# Altium schematic sheet 1_P1.schdoc
size 435 x 313 mm
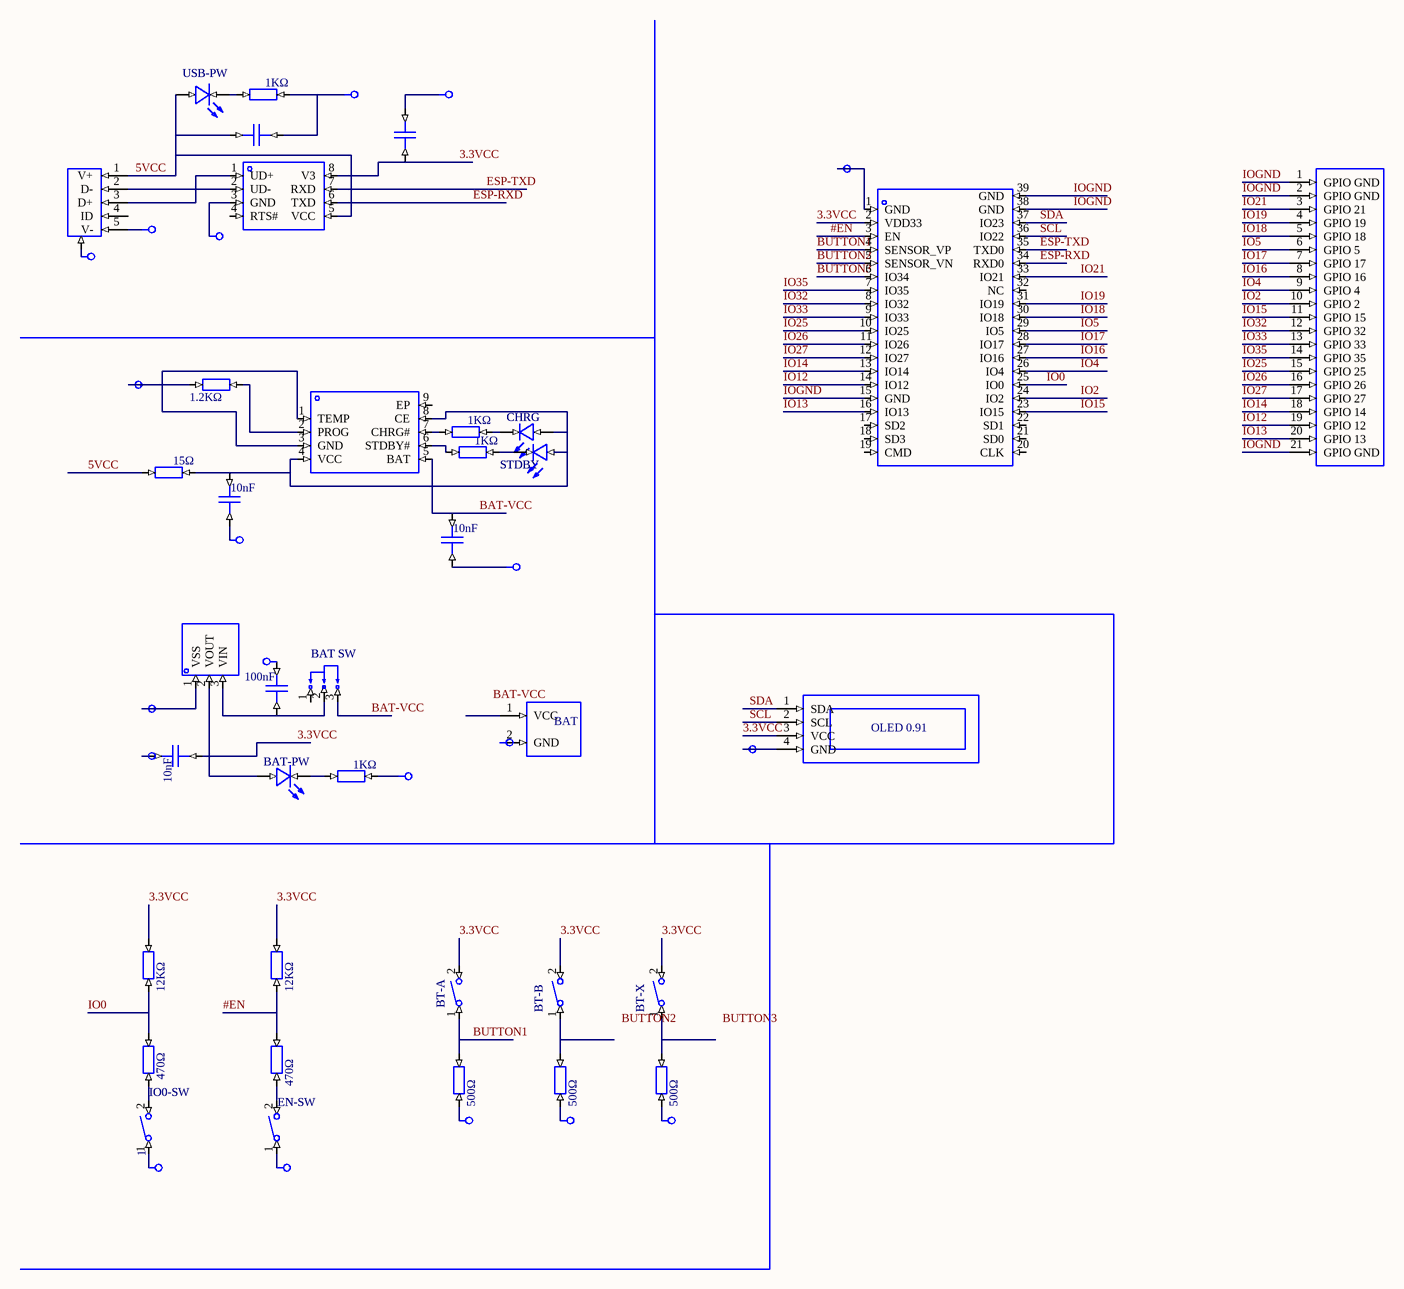
[diagram p0: 1_P1.schdoc]

## Parts
C1  value 100nF  [C0805]
C2  (no value)  [C0805]
C4  value 10nF  [C0805]
C5  value 10nF  [C0805]
C6  value 10nF  [C0805]
C7  (no value)  [C0805]
LDO1  (no value)  [SOT-23-3_L2.9-W1.6-P1.90-LS2.8-BR]
LED6  CHRG  [LED0805-R-RD]
LED7  STDBY  [LED0805-R-RD]
LED8  USB-PW  [LED0805-RD_RED]
LED9  BAT-PW  [LED0805-RD_RED]
R3  value 15Ω  [R0805]
R4  value 1KΩ  [R0805]
R5  value 1KΩ  [R0805]
R6  value 1.2KΩ  [R0805]
R7  value 1KΩ  [R0805]
R8  value 1KΩ  [R0805]
R10  value 12KΩ  [R0805]
R11  value 12KΩ  [R0805]
R12  value 470Ω  [R0805]
R13  value 470Ω  [R0805]
R15  value 500Ω  [R0805]
R16  value 500Ω  [R0805]
R17  value 500Ω  [R0805]
SW3  BAT SW  [SW-TH_SHOU-HAN_SS12D10G4]
U1  (no value)  [WIFIM-SMD_39P-L25.5-W18.0-P1.27-BL]
U2  (no value)  [SOP-8_L5.0-W4.0-P1.27-LS6.0-BL]
U3  (no value)  [SOP-8_L4.9-W3.9-P1.27-LS6.0-TL-EP-1]
U4  IO0-SW  NUMBER: 1  [SW-SMD_L4.0-W3.0-LS4.8-1]
U5  EN-SW  [SW-SMD_L4.0-W3.0-LS4.8-1]
U7  BT-A  [SW-SMD_L4.0-W3.0-LS4.8-1]
U8  BT-B  [SW-SMD_L4.0-W3.0-LS4.8-1]
U9  BT-X  [SW-SMD_L4.0-W3.0-LS4.8-1]
U11  (no value)  [ESP32 Pioneer OUT PIN20]
U12  (no value)  [0.91寸 OLED 屏幕模块]
U16  (no value)  [Battery Pin]
USB1  (no value)  [MICRO-USB]

## Nets
GND: C1.1 C2.2 C4.2 C5.2 C6.2 C7.2 LDO1.1(VSS) R6.1 R7.1 R8.1 R15.1 R16.1 R17.1 U1.1(GND) U2.3(GND) U3.1(TEMP) U3.3(GND) U4.1 U5.1 U12.4(GND) U16.2(GND) USB1.0(MTN6) USB1.5(V-)
3.3VCC: C4.1 C7.1 LDO1.2(VOUT) LED9.2(+) R10.2 R11.2 U1.2(VDD33) U2.8(V3) U7.2 U8.2 U9.2 U12.3(VCC)
5VCC: C2.1 LED8.2(+) R3.2 U2.5(VCC) USB1.1(V+)
#EN: R11.1 R13.2 U1.3(EN)
BAT-VCC: C6.1 SW3.3 U3.5(BAT)
BUTTON1: R15.2 U1.4(SENSOR_VP) U7.1
BUTTON2: U1.5(SENSOR_VN)
BUTTON3: U1.6(IO34)
ESP-RXD: U1.34(RXD0) U2.6(TXD)
ESP-TXD: U1.35(TXD0) U2.7(RXD)
IO0: R10.1 R12.2 U1.25(IO0)
IO2: U1.24(IO2) U11.10(GPIO_2)
IO4: U1.26(IO4) U11.9(GPIO_4)
IO5: U1.29(IO5) U11.6(GPIO_5)
IO12: U1.14(IO12) U11.19(GPIO_12)
IO13: U1.16(IO13) U11.20(GPIO_13)
IO14: U1.13(IO14) U11.18(GPIO_14)
IO15: U1.23(IO15) U11.11(GPIO_15)
IO16: U1.27(IO16) U11.8(GPIO_16)
IO17: U1.28(IO17) U11.7(GPIO_17)
IO18: U1.30(IO18) U11.5(GPIO_18)
IO19: U1.31(IO19) U11.4(GPIO_19)
IO21: U1.33(IO21) U11.3(GPIO_21)
IO25: U1.10(IO25) U11.15(GPIO_25)
IO26: U1.11(IO26) U11.16(GPIO_26)
IO27: U1.12(IO27) U11.17(GPIO_27)
IO32: U1.8(IO32) U11.12(GPIO_32)
IO33: U1.9(IO33) U11.13(GPIO_33)
IO35: U1.7(IO35) U11.14(GPIO_35)
IOGND: U1.15(GND) U1.38(GND) U1.39(GND) U11.1(GPIO_GND) U11.2(GPIO_GND) U11.21(GPIO_GND)
SCL: U1.36(IO22) U12.2(SCL)
SDA: U1.37(IO23) U12.1(SDA)
NetC1_2: C1.2 LDO1.3(VIN) SW3.2
NetC5_1: C5.1 LED6.1(A) LED7.1(A) R3.1 U3.4(VCC) U3.8(CE)
NetLED6_2: LED6.2(C) R5.1
NetLED7_2: LED7.2(C) R4.1
NetLED8_1: LED8.1(-) R7.2
NetLED9_1: LED9.1(-) R8.2
NetR4_2: R4.2 U3.6(STDBY#)
NetR5_2: R5.2 U3.7(CHRG#)
NetR6_2: R6.2 U3.2(PROG)
NetR12_1: R12.1 U4.2
NetR13_1: R13.1 U5.2
NetR16_2: R16.2 U8.1
NetR17_2: R17.2 U9.1
NetU2_1: U2.1(UD+) USB1.3(D+)
NetU2_2: U2.2(UD-) USB1.2(D-)

Not connected (* = marked no-connect by the designer): SW3 1; U1 17(SD2) 18(SD3) 19(CMD) 20(CLK) 21(SD0) 22(SD1) 32(NC); U2 4(RTS#); U3 9(EP); U16 1(VCC); USB1 4(ID)

## Notes on the sheet
- Labels drawn without touching a wire or pin: BAT-VCC, BUTTON2, BUTTON3
- (in symbol 0.91寸 OLED 屏幕模块_1) OLED 0.91
- (in symbol Battery Pin) BAT

## Library data of the parts
C1 C4-C6 = FM21X104K101ECG: Manufacturer: PSA(信昌电陶); Add into BOM: yes; Temperature Coefficient: X7R; Tolerance: ±10%; Voltage Rated: 100V; Description: 温度系数:X7R;容值:100nF;精度:±10%;额定电压:100V;; Symbol: FM21X104K101ECG; Device: FM21X104K101ECG; LCSC Part Name: 100nF ±10% 100V; Supplier Part: C148241; Manufacturer Part: FM21X104K101ECG; LCSC Stock: 829153; LCSC On Sale: 1; Supplier Footprint: 0805; Price: 0.036; JLCPCB Part Class: Extended Part; JLCPCB Stock: 150900; JLCPCB On Sale: 1; Datasheet: https://atta.szlcsc.com/upload/public/pdf/source/20171221/C148241_15138312092361195434.pdf; Supplier: LCSC; Convert to PCB: yes
C2 C7 = C0805X104K101T_C485772: Manufacturer: IHHEC(禾伸堂); Add into BOM: yes; Temperature Coefficient: X7R; Value: 100nF; Tolerance: ±10%; Voltage Rated: 100V; Description: 温度系数:X7R;容值:100nF;精度:±10%;额定电压:100V;; Symbol: C0805X104K101T_C485772; Device: C0805X104K101T_C485772; LCSC Part Name: 100nF ±10% 100V; Supplier Part: C485772; Manufacturer Part: C0805X104K101T; LCSC Stock: 1286668; LCSC On Sale: 1; Supplier Footprint: 0805; Price: 0.099; JLCPCB Part Class: Extended Part; JLCPCB Stock: 718060; JLCPCB On Sale: 1; Datasheet: https://atta.szlcsc.com/upload/public/pdf/source/20200117/C485772_1C2A03D89DC7D3F931FB9AFBA2903E68.pdf; Supplier: LCSC; Convert to PCB: yes
LDO1 = ME6209A33M3G: Manufacturer: MICRONE(南京微盟); Add into BOM: yes; Voltage Dropout (Max): 80mV @ 40mA(typ); Output Current (Max): 250mA; Output Configuration: 正; Voltage - Input (Max): 18V; Output Type: 固定; Number of Output Channels: 1; Current - Supply (Max): 4μA; Voltage - Output (Fixed): 3.3V; Description: 压降(max):80mV @ 40mA(typ);输出电压(可调):-;静态电流(Iq):-;最大输入电压:18V;输出类型:固定;输出电压(固定):3.3V;; Symbol: ME6209A33M3G; Device: ME6209A33M3G; LCSC Part Name: ME6209A33M3G; Supplier Part: C83508; Manufacturer Part: ME6209A33M3G; LCSC Stock: 86650; LCSC On Sale: 1; Supplier Footprint: SOT-23-3L; Price: 0.435; JLCPCB Part Class: Extended Part; JLCPCB Stock: 1130; JLCPCB On Sale: 1; Datasheet: https://atta.szlcsc.com/upload/public/pdf/source/20161212/1481539101152.pdf; Supplier: LCSC; Convert to PCB: yes; Voltage - Output (adj): -; Quiescent Current (Iq): -; Ripple Rejection (PSRR): -; Operating Temperature: -40℃~85℃; Enabling feet: -
LED6 LED7 = 17-21/GHC-XS1T2M/3T: Manufacturer: EVERLIGHT(台湾亿光); Add into BOM: yes; Illumination Color: 翠绿; Luminous Intensity (IF=20mA): 180~450mcd; Dominant Wavelength / Coordinate rank: 515~530nm; Description: 照明颜色:翠绿;色温 - CCT（K）:-;主波长/色坐标:515~530nm;; Symbol: 17-21/GHC-XS1T2M/3T; Device: 17-21/GHC-XS1T2M/3T; LCSC Part Name: 翠绿LED; Supplier Part: C63855; Manufacturer Part: 17-21/GHC-XS1T2M/3T; LCSC Stock: 184761; LCSC On Sale: 1; Supplier Footprint: 0805; Price: 0.267; JLCPCB Part Class: Extended Part; JLCPCB Stock: 38627; JLCPCB On Sale: 1; Datasheet: https://atta.szlcsc.com/upload/public/pdf/source/20151222/1457707652176.pdf; Supplier: LCSC; Convert to PCB: yes; Mounting Type: 表面贴装; Correlated Color Temperature - CCT(K): -; Luminous Flux/Radiant Flux: -
  LED6: Name: CHRG
  LED7: Name: STDBY
LED8 LED9 = NCD0805R1: Manufacturer: 国星光电; Symbol: FC-2012HRK-620D; Add into BOM: yes; Illumination Color: 红色; Luminous Intensity (IF=20mA): 67~195mcd; Dominant Wavelength / Coordinate rank: 615~630nm; Description: 照明颜色:红色;主波长/色坐标:615~630nm;; Device: NCD0805R1; LCSC Part Name: 红灯 0805 贴片LED; Supplier Part: C84256; Manufacturer Part: NCD0805R1; LCSC Stock: 1742470; LCSC On Sale: 1; Supplier Footprint: 0805; Price: 0.07; JLCPCB Part Class: Basic Part; JLCPCB Stock: 105919; JLCPCB On Sale: 1; Datasheet: https://atta.szlcsc.com/upload/public/pdf/source/20200820/C84256_F0A75A43B3EAD75808600A0514C76B99.pdf; Supplier: LCSC; Convert to PCB: yes; Mounting Type: 表面贴装
  LED8: Name: USB-PW
  LED9: Name: BAT-PW
R3-R6 = TC0550B150JT5E: Manufacturer: UNI-ROYAL(厚声); Add into BOM: yes; Temperature Coefficient: ±50ppm/℃; Power(Watts): 1/4W; Tolerance: ±0.1%; Overload Voltage (Max): 150V; Description: 温度系数:±50ppm/℃;阻值:15Ω;功率:1/4W;精度:±0.1%;工作温度范围:-55℃~+155℃;最大工作电压:150V;; Symbol: TC0550B150JT5E; Device: TC0550B150JT5E; LCSC Part Name: 15Ω ±0.1%; Supplier Part: C64288; Manufacturer Part: TC0550B150JT5E; LCSC Stock: 0; LCSC On Sale: 1; Supplier Footprint: 0805; Price: 0.25; JLCPCB Part Class: Extended Part; JLCPCB Stock: 0; JLCPCB On Sale: 1; Datasheet: https://atta.szlcsc.com/upload/public/pdf/source/20190404/C64288_0975AAA3CE83BB898B881ED2F6ECC9A4.pdf; Supplier: LCSC; Convert to PCB: yes; Operating Temperature Range: -55℃~+155℃
R7 R8 R10-R13 R15-R17 = TC0525B3241T5E: Manufacturer: UNI-ROYAL(厚声); Add into BOM: yes; Power(Watts): 250mW; Tolerance: ±0.1%; Overload Voltage (Max): 150V; Temperature Coefficient: ±25ppm/℃; Description: 工作温度范围:-55℃~+155℃;功率:250mW;电阻长:-;精度:±0.1%;电阻直径:-;电阻高:-;最大工作电压:150V;电阻宽:-;阻值:3.24kΩ;温度系数:±25ppm/℃;电阻类型:薄膜电阻;; Symbol: TC0525B3241T5E; Device: TC0525B3241T5E; LCSC Part Name: 3.24kΩ ±0.1%; Supplier Part: C64285; Manufacturer Part: TC0525B3241T5E; LCSC Stock: 20660; LCSC On Sale: 1; Supplier Footprint: 0805; Price: 0.259; JLCPCB Part Class: Extended Part; JLCPCB Stock: 90; JLCPCB On Sale: 1; Datasheet: https://atta.szlcsc.com/upload/public/pdf/source/20190404/C64285_98BBE841B3AD9F64F3238CC1E09794B8.pdf; Supplier: LCSC; Convert to PCB: yes; Operating Temperature Range: -55℃~+155℃; Body Length: -; φD: -; Body Height: -; Body Width: -; Type: 薄膜电阻
SW3 = SS12D10G4 071: Manufacturer: SHOU HAN(首韩); Add into BOM: yes; Description: 立式两档拨动,单排3脚插件,12.7x6.7x6.4,黑柄4MM; Symbol: SS12D10G4 071; Name: BAT SW; Device: SS12D10G4 071; LCSC Part Name: SS12D10G4 071; Supplier Part: C2887259; Manufacturer Part: SS12D10G4 071; LCSC Stock: 1048; LCSC On Sale: 1; Supplier Footprint: 插件; Price: 0.847; JLCPCB Part Class: Extended Part; JLCPCB Stock: 401; JLCPCB On Sale: 1; Datasheet: https://atta.szlcsc.com/upload/public/pdf/source/20210820/80D1704BBF3FCEE0435FCAA54C61E0A3.pdf; Supplier: LCSC; Convert to PCB: yes
U1 = ESP32-WROOM-32D: Manufacturer: ESPRESSIF 乐鑫; Add into BOM: yes; Description: ESP32-WROOM-32D 集成 ESP32-D0WD，功能强大，用途广泛，可以用于低功耗传感器网络和要求极高的任务，例如语音编码、音频流和 MP3 解码等。; Symbol: ESP32-WROOM-32D; Device: ESP32-WROOM-32D; LCSC Part Name: ESP32-WROOM-32D; Supplier Part: C473012; Manufacturer Part: ESP32-WROOM-32D; LCSC Stock: 1657; LCSC On Sale: 1; Supplier Footprint: SMD-38; Price: 20.48; JLCPCB Part Class: Extended Part; JLCPCB Stock: 5028; JLCPCB On Sale: 1; Datasheet: https://atta.szlcsc.com/upload/public/pdf/source/20191225/C473012_1E74417EE995DBCF17C94BD318A37DAB.pdf; Supplier: LCSC; Convert to PCB: yes
U2 = CH340N: Manufacturer: WCH(南京沁恒); Add into BOM: yes; Description: 类型:-;协议类别:-;驱动器/接收器数:-;数据速率:-;; Symbol: CH340N; Device: CH340N; LCSC Part Name: CH340N; Supplier Part: C506813; Manufacturer Part: CH340N; LCSC Stock: 0; LCSC On Sale: 1; Supplier Footprint: SOP-8; Price: 3.52; JLCPCB Part Class: Extended Part; JLCPCB Stock: 0; JLCPCB On Sale: 1; Datasheet: https://atta.szlcsc.com/upload/public/pdf/source/20200819/C84681_ADBED554CE321879DBD6B1D06488689C.pdf; Supplier: LCSC; Convert to PCB: yes; Type: -; Protocol: -; Number of Drivers/Receivers: -; Data Rate: -; Supply Voltage: -
U3 = TP4056X_C2763448: Manufacturer: TOPPOWER(南京拓微); Add into BOM: yes; Description: 充电电池的类型:-;电池单元组数:-;最大充电电流:-;充满的电池组电压:-;最大供应电压:-;; Symbol: TP4056X_C2763448; Device: TP4056X_C2763448; LCSC Part Name: TP4056X; Supplier Part: C2763448; Manufacturer Part: TP4056X; LCSC Stock: 50301; LCSC On Sale: 1; Supplier Footprint: SOP-8EP_150mil; Price: 1.347; JLCPCB Part Class: Extended Part; JLCPCB Stock: 0; JLCPCB On Sale: 1; Datasheet: https://atta.szlcsc.com/upload/public/pdf/source/20180424/C191323_1370BE5C4DD73DE4435E0781559DEFAC.pdf; Supplier: LCSC; Convert to PCB: yes; Battery Chemistry: -; Number of Cells: -; Charge Current - Max: -; Battery Pack Voltage: -; Voltage - Supply (Max): -; Interface: -
U4 U5 U7-U9 = 3*4 龟仔/微动/轻触开关: Add into BOM: yes; Symbol: 3*4 龟仔/微动/轻触开关; Device: 3*4 龟仔/微动/轻触开关; LCSC Part Name: 3*4 龟仔/微动/轻触开关; Supplier Part: C9900001368; Manufacturer Part: 3*4 龟仔/微动/轻触开关; LCSC Stock: 0; LCSC On Sale: 0; Supplier Footprint: SMD; Price: 0; JLCPCB Part Class: Extended Part; JLCPCB Stock: 0; JLCPCB On Sale: 0; Datasheet: https://img.jlc.com//pdf/applyPasteComponent/null; Supplier: LCSC; Convert to PCB: yes
  U4: Name: IO0-SW
  U5: Name: EN-SW
  U7: Name: BT-A
  U8: Name: BT-B
  U9: Name: BT-X
U11 = ESP32 Pioneer OUT PIN: Symbol: ESP32 Pioneer OUT PIN 20; Convert to PCB: yes; Device: ESP32 Pioneer OUT PIN; Add into BOM: yes
U12 = 0.91寸 OLED 屏幕模块_1: Convert to PCB: yes; Symbol: 0.91寸 OLED 屏幕模块; Device: 0.91寸 OLED 屏幕模块_1; Add into BOM: yes
U16 = Battery Pin: Convert to PCB: yes; Symbol: Battery Pin; Device: Battery Pin; Add into BOM: yes
USB1 = 920-a52a2021s10110: Manufacturer: 精拓金; Symbol: micro 5PFour-legged board7.2There is a column card point0.4m; Add into BOM: yes; Connector Type: Micro-B; Gender: 母座; Number of Contacts: 5; Number of Ports: 1; Description: 连接器类型:Micro-B;标准:USB 2.0;公母:母座;触点数量:5;端口数量:1;; Device: 920-a52a2021s10110; LCSC Part Name: Micro-B 母座; Supplier Part: C40943; Manufacturer Part: 920-A52A2021S10110; LCSC Stock: 1736; LCSC On Sale: 1; Supplier Footprint: SMD; Price: 0.575; JLCPCB Part Class: Extended Part; JLCPCB Stock: 16425; JLCPCB On Sale: 1; Datasheet: https://atta.szlcsc.com/upload/public/pdf/source/20210308/C40943_CF48C612F3E2DE544D56AAF78AA9E19E.pdf; Supplier: LCSC; Convert to PCB: yes; Standard: USB 2.0